# EAGLE design ADC (EAGLE 7.2.0)
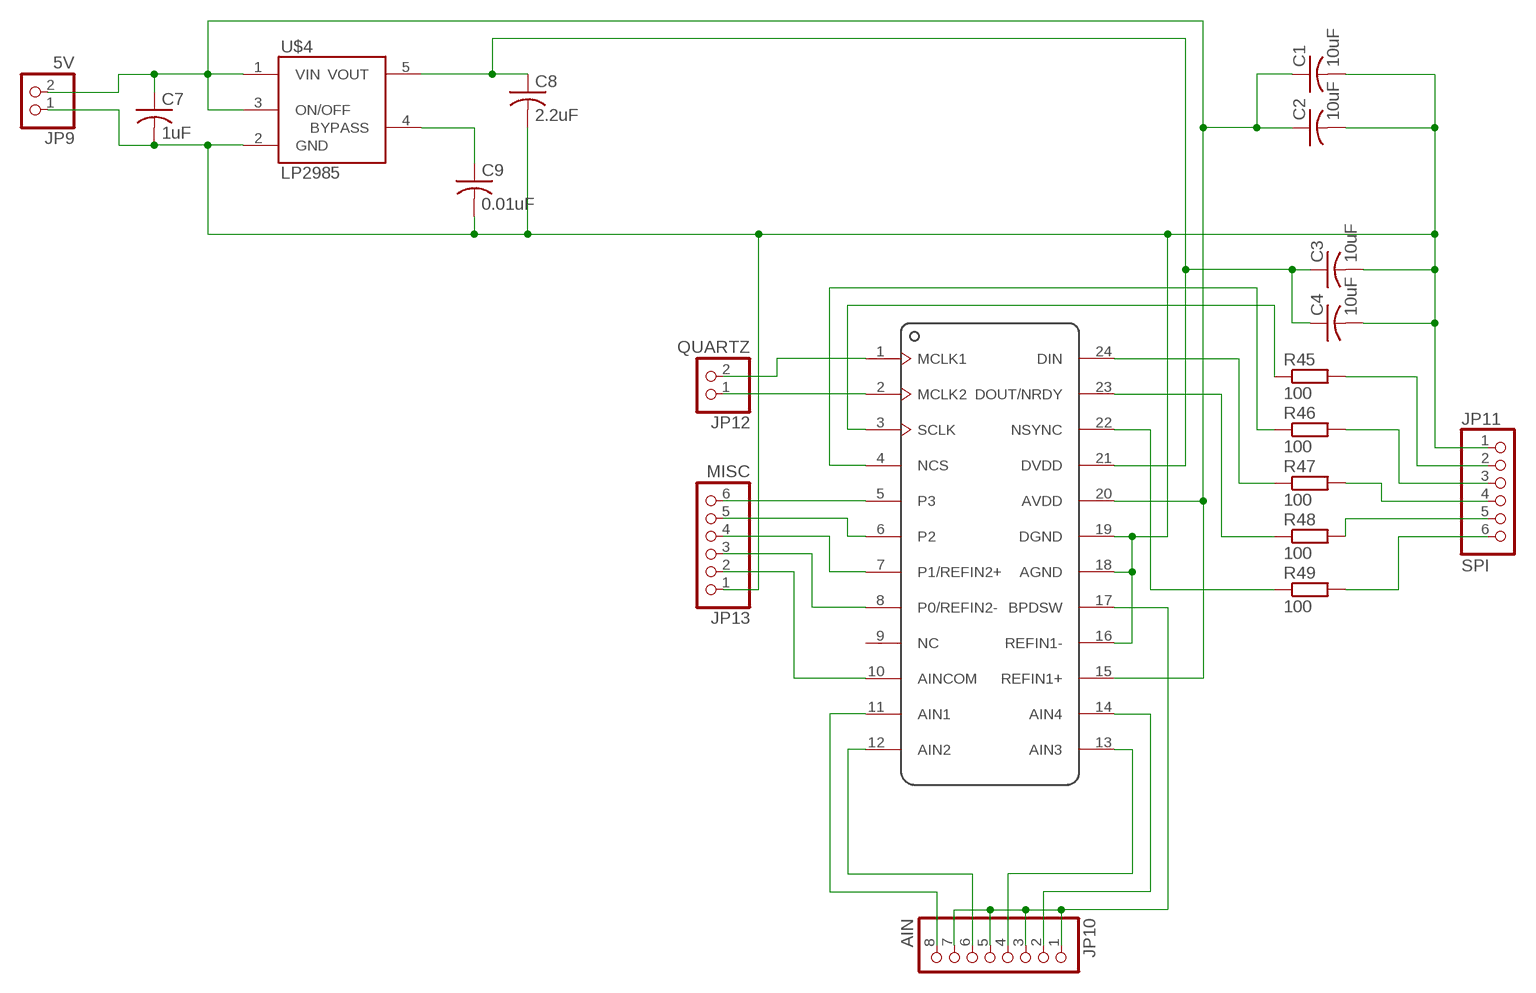
[diagram p0: schematic, sheet 1]

## Parts
C1  10uF  C-USC0603  [C0603]
C2  10uF  C-USC0603  [C0603]
C3  10uF  C-USC0603  [C0603]
C4  10uF  C-USC0603  [C0603]
C7  1uF  C-USC0603  [C0603]
C8  2.2uF  C-USC0603  [C0603]
C9  0.01uF  C-USC0603  [C0603]
JP9  5V  PINHD-1X2  [1X02]
JP10  AIN  PINHD-1X8  [1X08]
JP11  SPI  PINHD-1X6  [1X06]
JP12  QUARTZ  PINHD-1X2  [1X02]
JP13  MISC  PINHD-1X6  [1X06]
R45  100  R-EU_R1206  [R1206]
R46  100  R-EU_R1206  [R1206]
R47  100  R-EU_R1206  [R1206]
R48  100  R-EU_R1206  [R1206]
R49  100  R-EU_R1206  [R1206]
U$3  AD7190  [TSSOP24]
U$4  LP2985AIM5-3.3  [SOT25]

## Nets
BYPASS: C9.1 U$4.4(BYPASS)
N$1: JP11.5 R48.2
N$2: R45.1 U$3.3(SCLK)
N$3: R46.1 U$3.4(NCS)
N$4: R47.1 U$3.24(DIN)
N$5: R48.1 U$3.23(DOUT/NRDY)
N$6: R49.1 U$3.22(NSYNC)
N$8: C1.1 C2.1 C7.1 JP9.2 U$3.15(REFIN1+) U$3.20(AVDD) U$4.1(VIN) U$4.3(ON/OFF)
N$9: C3.1 C4.1 C8.1 U$3.21(DVDD) U$4.5(VOUT)
N$97: JP10.1 JP10.3 JP10.5 JP10.7 U$3.17(BPDSW)
N$102: JP11.2 R45.2
N$103: JP11.3 R46.2
N$104: JP11.4 R47.2
N$106: JP11.6 R49.2
N$112: JP10.8 U$3.11(AIN1)
N$113: JP10.6 U$3.12(AIN2)
N$114: JP10.4 U$3.13(AIN3)
N$115: JP10.2 U$3.14(AIN4)
N$116: C1.2 C2.2 C3.2 C4.2 C7.2 C8.2 C9.2 JP9.1 JP11.1 JP13.1 U$3.16(REFIN1-) U$3.18(AGND) U$3.19(DGND) U$4.2(GND)
N$117: JP12.2 U$3.1(MCLK1)
N$118: JP12.1 U$3.2(MCLK2)
N$119: JP13.6 U$3.5(P3)
N$120: JP13.5 U$3.6(P2)
N$121: JP13.4 U$3.7(P1/REFIN2+)
N$122: JP13.3 U$3.8(P0/REFIN2-)
N$123: JP13.2 U$3.10(AINCOM)
Unconnected: U$3.9(NC)

## Library data of the parts
C1-C4 C7-C9 = adafruit:C-US: CAPACITOR, American symbol
JP9 JP12 = pinhead:PINHD-1X2: PIN HEADER
JP10 = pinhead:PINHD-1X8: PIN HEADER
JP11 JP13 = pinhead:PINHD-1X6: PIN HEADER
R45-R49 = resistor:R-EU_: RESISTOR, European symbol
U$3 = analog-devices:AD7190: AD7190 - 4.8 kHz Ultralow Noise 24-Bit Sigma-Delta ADC with PGA RMS noise: 8.5 nV @ 4.7 Hz (gain = 128) 16 noise free bits @ 2.4 kHz (gain = 128) Up to 22.5 noise free bits (gain = 1) Offset drift: 5 nV/°C Gain drift: 1 ppm/°C Specified drift over time 2 differential/4 pseudo differential input channels Automatic channel sequencer Programmable gain (1 to 128) Output data rate: 4.7 Hz to 4.8 kHz Internal or external clock Simultaneous 50 Hz/60 Hz rejection 4 general-purpose digital outputs Power supply AV DD : 4.75 V to 5.25 V DV DD : 2.7 V to 5.25 V Current: 6 mA Temperature range: –40°C to +105°C Interface: 3-wire serial SPI, QSPITM, MICROWIRETM, and DSP compatible Schmitt trigger on SCLK Qualified for automotive applications
U$4 = LP2985:LP2985: LP2985-N Micropower 150 mA Low-Noise Ultra Low-Dropout Regulator

## Board
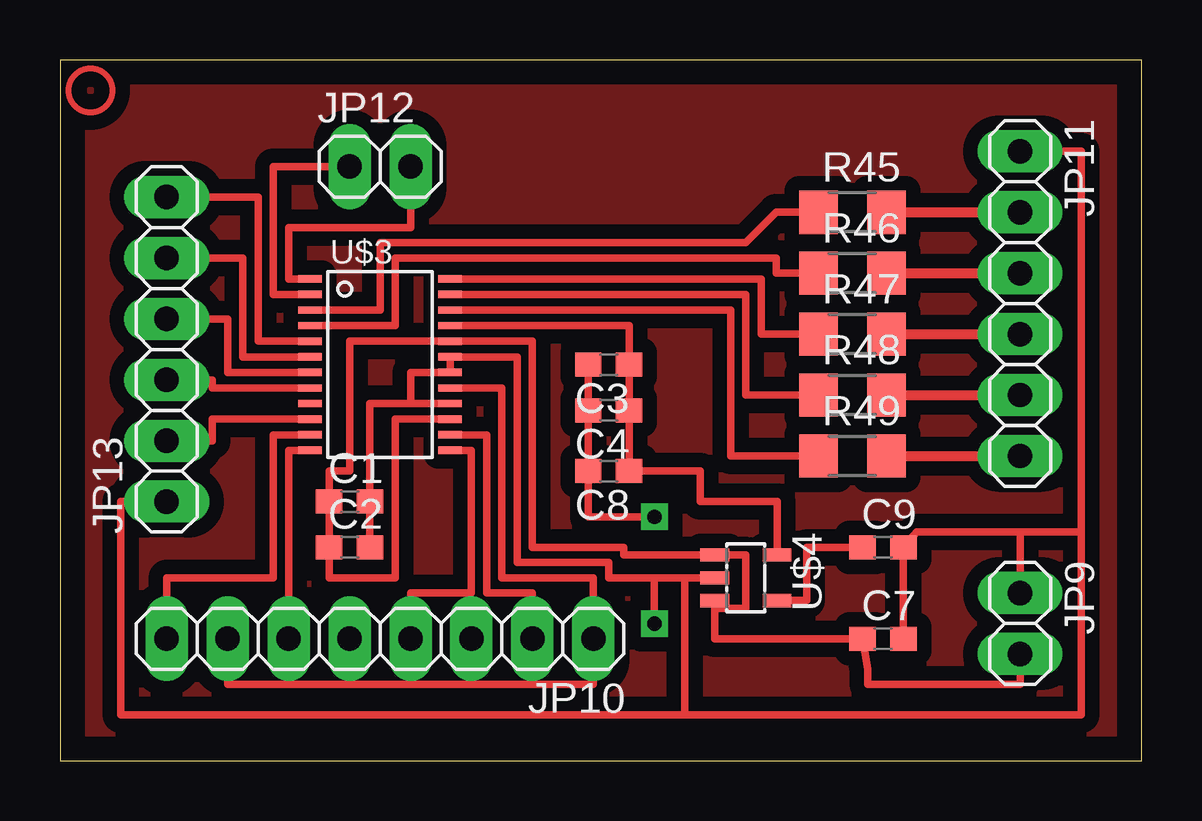
[diagram p1: board, top side]
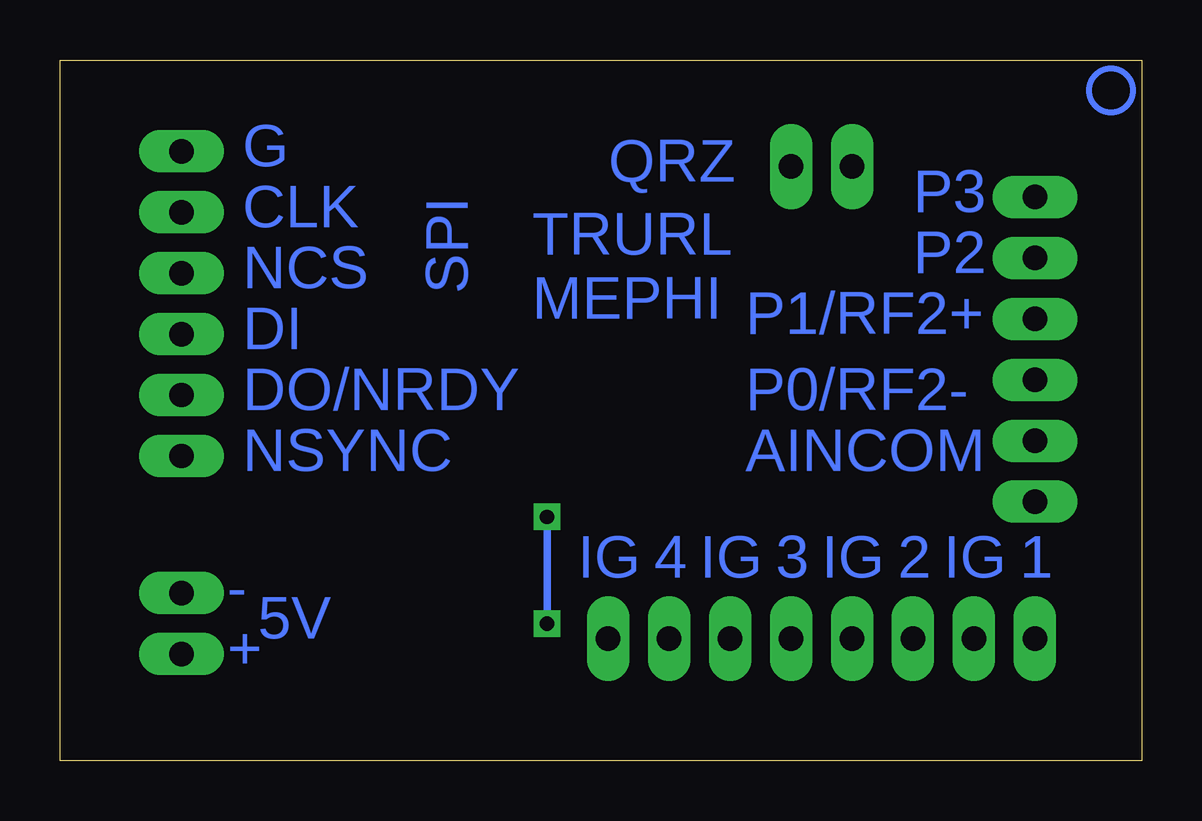
[diagram p2: board, bottom side, seen from below]

Size 45.06 x 29.21 mm. Coordinates in mm from the lower left corner, seen from the top.
Outline: 0,0 45.06,0 45.06,29.21 0,29.21 0,0
Copper layers (1*16): Top 0.035mm / dielectric 1.5mm / Bottom 0.035mm
Design rules "default *": minimum track width 10mil, minimum drill 24mil, track to track 8mil, track to pad 8mil, pad to pad 8mil, via to via 8mil, smd to smd 8mil, copper to edge 40mil, drill to drill 8mil, minimum pad ring 15mil, minimum via ring 10mil, stop-mask expansion 4mil, vias tented up to drill 0mil, thermal gap 10mil

### Footprints (pad centres in the part's own frame; a part is rotated, then mirrored left to right if it is on the bottom)
C0603 = smd 1.1 x 1: 1 -0.85,0; 2 0.85,0
1X02 = drill 1.016 long: 1 -1.27,0; 2 1.27,0
1X08 = drill 1.016 long: 1 -8.89,0; 2 -6.35,0; 3 -3.81,0; 4 -1.27,0; 5 1.27,0; 6 3.81,0; 7 6.35,0; 8 8.89,0
1X06 = drill 1.016 long: 1 -6.35,0; 2 -3.81,0; 3 -1.27,0; 4 1.27,0; 5 3.81,0; 6 6.35,0
R1206 = smd 1.6 x 1.803: 1 -1.422,0; 2 1.422,0
TSSOP24 = smd 0.305 x 0.991: 1 -3.575,-2.918; 2 -2.925,-2.918; 3 -2.275,-2.918; 4 -1.625,-2.918; 5 -0.975,-2.918; 6 -0.325,-2.918; 7 0.325,-2.918; 8 0.975,-2.918; 9 1.625,-2.918; 10 2.275,-2.918; 11 2.925,-2.918; 12 3.575,-2.918; 13 3.575,2.918; 14 2.925,2.918; 15 2.275,2.918; 16 1.625,2.918; 17 0.975,2.918; 18 0.325,2.918; 19 -0.325,2.918; 20 -0.975,2.918; 21 -1.625,2.918; 22 -2.275,2.918; 23 -2.925,2.918; 24 -3.575,2.918
SOT25 = smd 0.55 x 1.2: 1 -0.95,-1.3; 2 0,-1.3; 3 0.95,-1.3; 4 0.95,1.3; 5 -0.95,1.3

### Placement (x,y rotation side)
C1  12.06,10.79 0 top
C2  12.06,8.89 0 top
C3  22.86,16.51 180 top
C4  22.86,14.61 180 top
C7  34.29,5.08 0 top
C8  22.86,12.06 180 top
C9  34.29,8.89 0 top
JP9  40.01,5.71 270 top
JP10  13.34,5.08 180 top
JP11  40.01,19.05 270 top
JP12  13.34,24.77 0 top
JP13  4.45,17.14 90 top
R45  33.02,22.86 0 top
R46  33.02,20.32 0 top
R47  33.02,17.78 0 top
R48  33.02,15.24 0 top
R49  33.02,12.7 0 top
U$3  13.34,16.51 270 top
U$4  28.57,7.62 270 top

### Tracks (layer width: path | path; a pad name or v marks a point on that pad's centre or on a via)
BYPASS
  Top 0.305: U$4.4 31.11,6.67 31.11,8.89 C9.1
N$1
  Top 0.406: R48.2 JP11.5
N$2
  Top 0.305: U$3.3 13.34,18.79 13.34,21.59 28.57,21.59 29.84,22.86 R45.1
N$3
  Top 0.305: U$3.4 13.97,18.14 13.97,20.95 29.84,20.95 29.84,20.32 R46.1
N$4
  Top 0.305: U$3.24 29.21,20.09 29.21,17.78 R47.1
N$5
  Top 0.305: U$3.23 28.57,19.43 28.57,15.24 R48.1
N$6
  Top 0.305: U$3.22 27.94,18.79 27.94,12.7 R49.1
N$7
  pour Top (isolate 0.61): 0,0 45.09,0 45.09,29.21 0,29.21
N$8
  Top 0.305: JP9.2 40.01,3.17 33.66,3.17 33.66,3.81 C7.1 27.27,5.08 U$4.3 27.27,6.35 28.57,6.35 28.57,8.57 U$4.1 23.5,8.57 23.5,8.89 19.68,8.89 19.68,17.48 U$3.20 12.06,17.48 12.06,12.06 11.21,12.06 C1.1 C2.1 11.21,7.62 13.97,7.62 13.97,14.23 U$3.15
N$9
  Top 0.305: U$4.5 29.88,10.79 26.67,10.79 26.67,12.06 C8.1 C4.1 C3.1 23.71,18.14 U$3.21
N$10
  pour Top (isolate 0.61): 0,0 45.09,0 45.09,29.21 0,29.21
N$97
  Top 0.305: U$3.17 18.41,15.54 18.41,7.62 22.23,7.62 JP10.1 22.23,3.17 17.14,3.17 | JP10.3 17.14,3.17 | JP10.5 12.06,3.17 | 12.06,3.17 17.14,3.17 | JP10.7 6.99,3.17 12.06,3.17
N$102
  Top 0.406: R45.2 JP11.2
N$103
  Top 0.406: R46.2 JP11.3
N$104
  Top 0.406: R47.2 JP11.4
N$106
  Top 0.406: R49.2 JP11.6
N$112
  Top 0.305: U$3.11 8.89,13.59 8.89,7.62 4.45,7.62 JP10.8
N$113
  Top 0.305: U$3.12 9.53,12.94 JP10.6
N$114
  Top 0.305: U$3.13 17.14,12.94 17.14,6.99 14.61,6.99 JP10.4
N$115
  Top 0.305: U$3.14 17.78,13.59 17.78,6.99 19.68,6.99 JP10.2
N$116  (via drill 0.6)
  Top 0.305: 24.77,7.62 U$4.2 26.04,7.62 26.04,1.91 | 24.77,7.62 22.86,7.62 22.86,8.26 19.05,8.26 19.05,16.84 U$3.19 U$3.18 14.61,16.18 14.61,14.88 | 22.23,12.06 C8.2 C4.2 C3.2 22.01,10.16 v24.77,10.16 | v24.77,5.71 24.77,7.62 | JP11.1 42.55,25.4 42.55,9.53 | 42.55,9.53 40.01,9.53 | 40.01,9.53 JP9.1 | 40.01,9.53 35.69,9.53 C9.2 C7.2 | 26.04,1.91 42.55,1.91 42.55,9.53 | JP13.1 2.54,10.79 2.54,1.91 26.04,1.91 | 14.61,14.88 12.91,14.88 C1.2 C2.2 | 14.61,14.88 U$3.16
  Bottom 0.305: v24.77,10.16 v24.77,5.71
N$117
  Top 0.305: U$3.1 9.53,20.09 9.53,22.23 14.61,22.23 JP12.2
N$118
  Top 0.305: U$3.2 8.89,19.43 8.89,24.77 JP12.1
N$119
  Top 0.305: U$3.5 8.26,17.48 8.26,23.5 JP13.6
N$120
  Top 0.305: U$3.6 7.62,16.84 7.62,20.95 JP13.5
N$121
  Top 0.305: U$3.7 6.99,16.18 6.99,18.41 JP13.4
N$122
  Top 0.305: U$3.8 6.35,15.54 6.35,15.88 JP13.3
N$123
  Top 0.305: U$3.10 6.35,14.23 6.35,13.34 JP13.2
(copper drawn outside any net)
  shapes: Bottom circle x1, Top circle x1

### Text on the board
Bottom: G | QRZ | P3 | SPI | CLK | P2 | NCS | P1/RF2+ | TRURL / MEPHI | DI | P0/RF2- | DO/NRDY | AINCOM | NSYNC | 1 | IG | 2 | IG | 3 | IG | 4 | IG | - | 5V | +